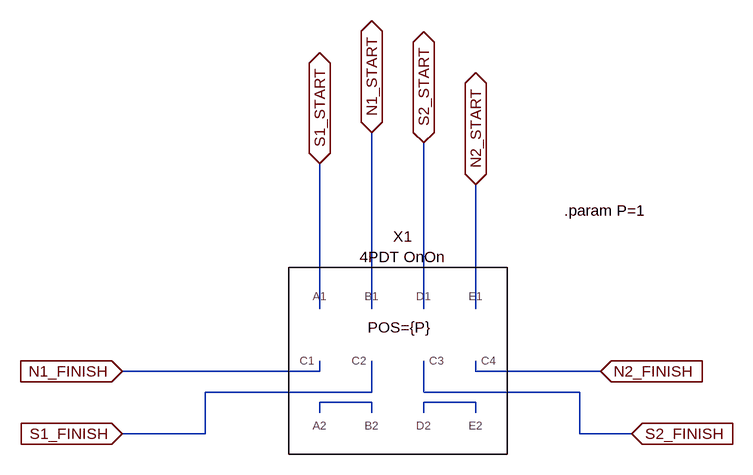
[diagram p0: schematic SeriesParallel_4PDT.asc]
SeriesParallel_4PDT.asc, the LTspice schematic file:
Version 4
SHEET 1 916 680
WIRE 112 112 112 -112
WIRE 192 112 192 -160
WIRE 272 112 272 -144
WIRE 352 112 352 -80
WIRE 112 208 112 192
WIRE 112 208 -192 208
WIRE 352 208 352 192
WIRE 544 208 352 208
WIRE 192 240 192 192
WIRE 192 240 -64 240
WIRE 272 240 272 192
WIRE 512 240 272 240
WIRE 192 256 112 256
WIRE 352 256 272 256
WIRE 112 272 112 256
WIRE 192 272 192 256
WIRE 272 272 272 256
WIRE 352 272 352 256
WIRE -64 304 -64 240
WIRE -64 304 -192 304
WIRE 512 304 512 240
WIRE 592 304 512 304
FLAG -192 208 N1_FINISH
IOPIN -192 208 In
FLAG -192 304 S1_FINISH
IOPIN -192 304 In
FLAG 544 208 N2_FINISH
IOPIN 544 208 In
FLAG 592 304 S2_FINISH
IOPIN 592 304 In
FLAG 112 -112 S1_START
IOPIN 112 -112 BiDir
FLAG 192 -160 N1_START
IOPIN 192 -160 BiDir
FLAG 272 -144 S2_START
IOPIN 272 -144 BiDir
FLAG 352 -80 N2_START
IOPIN 352 -80 BiDir
SYMBOL 4PDT_OnOn 240 192 R0
WINDOW 39 -6 -36 Bottom 2
SYMATTR InstName X1
SYMATTR SpiceLine POS={P}
TEXT 488 -40 Left 2 !.param P=1

The netlist it stands for:
* SeriesParallel_4PDT.asc
XX1 S1_START N001 N1_START N001 N1_FINISH S1_FINISH S2_FINISH N2_FINISH S2_START N002 N2_START N002 4PDT OnOn POS={P}  ; pins A1 A2 B1 B2 C1 C2 C3 C4 D1 D2 E1 E2
.param P=1
.backanno
.end